# Altium project PD_SMARTKEY_EMN-EVAN_V2.0.PrjPcb
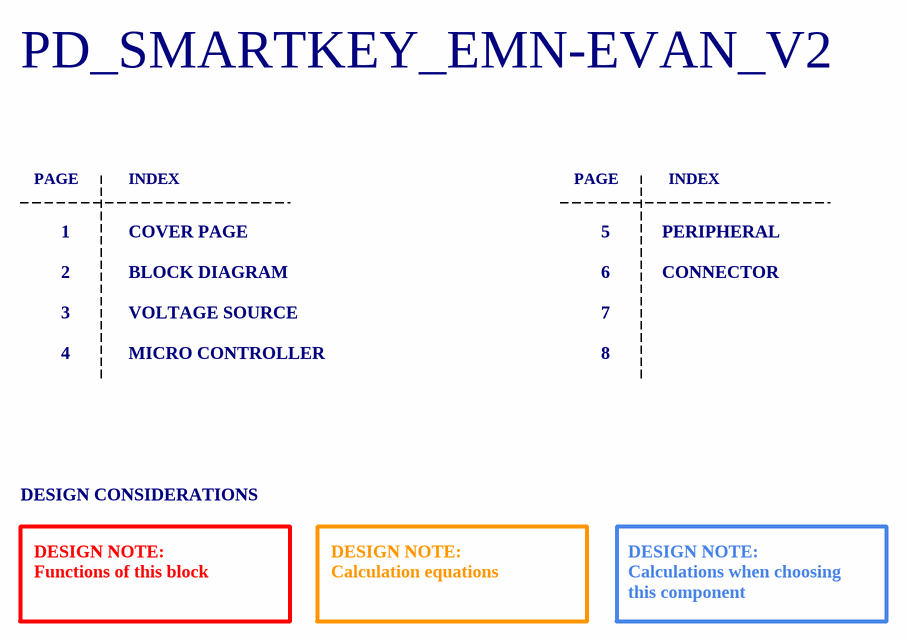
[diagram p0: Cover Page.SchDoc]
6 sheets, 81 parts. Net scope: global (net labels, ports and power ports of the same name join across sheets).
Sheets:
  Cover Page.SchDoc
  Block Diagram.SchDoc
  Voltage Source.SchDoc
  Micro Controller.SchDoc
  Peripheral.SchDoc
  Connector.SchDoc

## Sheet Cover Page.SchDoc
size A4; SheetNumber: 1; SheetTotal: 6

### Notes on the sheet
- PD_SMARTKEY_EMN-EVAN_V2
- PAGE
- INDEX
- 1
- 2
- COVER PAGE
- BLOCK DIAGRAM
- 5
- 6
- PERIPHERAL
- CONNECTOR
- 3
- 4
- VOLTAGE SOURCE
- MICRO CONTROLLER
- 7
- 8
- DESIGN CONSIDERATIONS
- DESIGN NOTE:
  Functions of this block
- DESIGN NOTE:
  Calculation equations
- DESIGN NOTE:
  Calculations when choosing this component
- Author:
- Title:
- Size:
- A4
- Project:
- Approved:
- Revision:
- Modified Date:
- CONFIDENTIAL
- Date:
- SW Version:

## Sheet Block Diagram.SchDoc
size A4; SheetNumber: 2; SheetTotal: 5

### Notes on the sheet
- Author:
- Title:
- Size:
- A4
- Project:
- Approved:
- Revision:
- Modified Date:
- CONFIDENTIAL
- Date:
- SW Version:

## Sheet Voltage Source.SchDoc
size A4; SheetNumber: 3; SheetTotal: 5
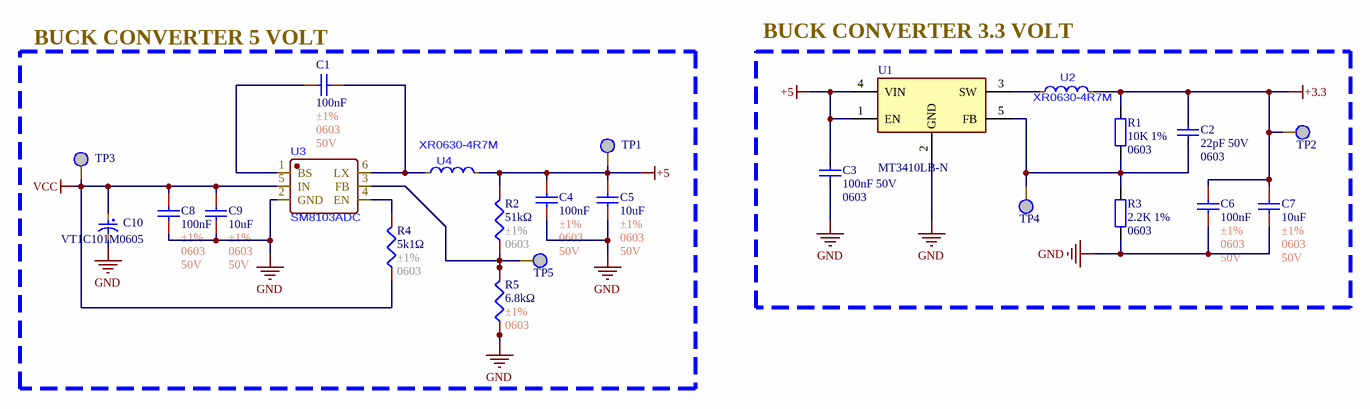
[diagram p1: Voltage Source.SchDoc]

### Parts
C1  100nF  Tolerance: ±1%  Package: 0603  Voltage Rating: 50V  [C0603]
C2  22pF 50V  Package: 0603  [C0603]
C3  100nF 50V  Package: 0603  [C0603]
C4  100nF  Tolerance: ±1%  Package: 0603  Voltage Rating: 50V  [C0603]
C5  10uF  Tolerance: ±1%  Package: 0603  Voltage Rating: 50V  [C0603]
C6  100nF  Tolerance: ±1%  Package: 0603  Voltage Rating: 50V  [C0603]
C7  10uF  Tolerance: ±1%  Package: 0603  Voltage Rating: 50V  [C0603]
C8  100nF  Tolerance: ±1%  Package: 0603  Voltage Rating: 50V  [C0603]
C9  10uF  Tolerance: ±1%  Package: 0603  Voltage Rating: 50V  [C0603]
C10  VT1C101M0605  [C_100uF_16V_Aluminum]
R1  10K 1%  Package: 0603  [RES_SMD_0603]
R2  51kΩ  Tolerance: ±1%  Package: 0603  [R0603]
R3  2.2K 1%  Package: 0603  [RES_SMD_0603]
R4  5k1Ω  Tolerance: ±1%  Package: 0603  [R0603]
R5  6.8kΩ  Tolerance: ±1%  Package: 0603  [R0603]
TP1  TP  [TP]  (value not drawn)
TP2  TP  [TP]  (value not drawn)
TP3  TP  [TP]  (value not drawn)
TP4  TP  [TP]  (value not drawn)
TP5  TP  [TP]  (value not drawn)
U1  MT3410LB-N  [SOT23_5]
U2  XR0630-4R7M  [SMD,7x6.6mm]
U3  SM8103ADC  [TSOT-23-6]
U4  XR0630-4R7M  [SMD,7x6.6mm]

### Blocks framed on the sheet
BUCK CONVERTER 5 VOLT: C1 C4 C5 C8-C10 R2 R4 R5 TP1 TP3 TP5 U3 U4
BUCK CONVERTER 3.3 VOLT: C2 C3 C6 C7 R1 R3 TP2 TP4 U1 U2

### Nets
+3.3: C2.2 C6.1 C7.1 R1.2 TP2.1 U2.2(F)
+5: C3.2 C4.1 C5.1 R2.2 TP1.1 U1.1(EN) U1.4(VIN) U4.2(F)
GND: C3.1 C4.2 C5.2 C6.2 C7.2 C8.2 C9.2 C10.2 R3.1 R5.1 U1.2(GND) U3.2(GND)
VCC: C8.1 C9.1 C10.1 R4.1 TP3.1 U3.5(IN)
NetC1_1: C1.1 U3.6(LX) U4.1(S)
NetC1_2: C1.2 U3.1(BS)
NetC2_1: C2.1 R1.1 R3.2 TP4.1 U1.5(FB)
NetR2_1: R2.1 R5.2 TP5.1 U3.3(FB)
NetR4_2: R4.2 U3.4(EN)
NetU1_3: U1.3(SW) U2.1(S)

### Notes on the sheet
- Author:
- Title:
- Size:
- A4
- Project:
- Approved:
- Revision:
- Modified Date:
- CONFIDENTIAL
- Date:
- SW Version:

### Library data of the parts
C1 C4 C6 C8 = C0603_100nF_±1%: Manufacturer: YAGEO; Mfr. Part #: CC0402FRNPO9BN100; LCSC Part #: C513681; Link: https://www.lcsc.com/product-detail/C513681.html?s_z=n_capital%2520yageo%252010pF%25200402; Capacitance: 100nF
C2 = C0603_MLCC_22pF_50V: 50V 22pF NP0 ±5% 0603 Multilayer Ceramic Capacitors MLCC - SMD/SMT ROHS; Manufacturer: YAGEO; Manufacture Part Number: CC0603JRNPO9BN220; Packaging: Cut Tape (CT); Link: https://www.lcsc.com/product-detail/Multilayer-Ceramic-Capacitors-MLCC-SMD-SMT_YAGEO-CC0603JRNPO9BN220_C105620.html?s_z=n_22pF%2050V%200603
C3 = C0603_MLCC_100nF_50V: 50V 100nF X7R ±10% 0603 Multilayer Ceramic Capacitors MLCC - SMD/SMT ROHS; Manufacturer: YAGEO; Manufacture Part Number: CC0603KRX7R9BB104; Packaging: Cut Tape (CT); Link: https://www.lcsc.com/product-detail/Multilayer-Ceramic-Capacitors-MLCC-SMD-SMT_YAGEO-CC0603KRX7R9BB104_C14663.html?s_z=n_100nF%2050V%200603
C5 C7 C9 = C0603_10uF_±1%: Manufacturer: YAGEO; Mfr. Part #: CC0402FRNPO9BN100; LCSC Part #: C513681; Link: https://www.lcsc.com/product-detail/C513681.html?s_z=n_capital%2520yageo%252010pF%25200402; Capacitance: 10uF
C10 = C_100uF_16V_aluminum: 100uF 16V ±20% 63mA@120Hz SMD,D6.3xL5.4mm Aluminum Electrolytic Capacitors RoHS; Manufacturer: ROQANG; Key Attributes: CAP ALUM 100uF ±20% 16V SMD; Mfr. Part #: VT1C101M0605; LCSC Part #: C90273; Package: SMD,D6.3xL5.4mm; Link: https://www.lcsc.com/product-detail/C90273.html?s_z=n_capital%2520100uf%2520aluminum
R1 = R0603_10K: 10 kOhms ±1% 0.1W, 1/10W Chip Resistor 0603 (1608 Metric) Moisture Resistant Thick Film; Manufacturer: YAGEO; Manufacture Part Number: RC0603FR-0710KL; Packaging: Cut Tape (CT); Link: https://www.digikey.com/en/products/detail/yageo/RC0603FR-0710KL/726880
R2 = R0603_51kΩ_±1%: 100mW Thick Film Resistor 75V ±100ppm/℃ ±1% 51kΩ 0603 Chip Resistor - Surface Mount ROHS; Manufacturer: FOJAN; Mfr. Part #: FRC0603F5101TS; Key Attributes: RES 5.1kΩ ±1% 100mW 0603; LCSC Part #: C2907044; Link: https://www.lcsc.com/product-detail/C2907044.html?s_z=n_5k1%25200603; Resistance: 51kΩ
R3 = R0603_2.2K: 2.2 kOhms ±1% 0.1W, 1/10W Chip Resistor 0603 (1608 Metric) Moisture Resistant Thick Film; Manufacturer: YAGEO; Manufacture Part Number: RC0603FR-072K2L; Packaging: Cut Tape (CT); Link: https://www.digikey.com/en/products/detail/yageo/RC0603FR-072K2L/727016
R4 = R0603_5k1Ω_±1%: 100mW Thick Film Resistor 75V ±100ppm/℃ ±1% 5.1kΩ 0603 Chip Resistor - Surface Mount ROHS; Manufacturer: FOJAN; Mfr. Part #: FRC0603F5101TS; Key Attributes: RES 5.1kΩ ±1% 100mW 0603; LCSC Part #: C2907044; Link: https://www.lcsc.com/product-detail/C2907044.html?s_z=n_5k1%25200603; Resistance: 5k1Ω
R5 = R0603_6.8kΩ_±1%_1: 6.8k; Manufacturer: YAGEO; Mfr. Part #: RC0402FR-0710RL; LCSC Part #: C138066; Resistance: 6.8kΩ; Link: https://www.lcsc.com/product-detail/C138066.html?s_z=n_resistor%25200402%252010R
U1 = MT3410LB-N: SOT-23-5 DC-DC Converters ROHS; Manufacturer: XI'AN Aerosemi Tech; Manufacture Part Number: MT3410LB-N; Packaging: Cut Tape; Link: https://www.lcsc.com/product-detail/DC-DC-Converters_XI-AN-Aerosemi-Tech-MT3410LB-N_C42420805.html?s_z=n_mt3410l; Package: SOT-23-5
U2 U4 = FIXED IND 4.7uH 6A 33mΩ SMD,0630: Manufacturer: XR; MPN: XR0630-4R7M; LCSC Part #: C5307631; Packaging: SMD,7x6.6mm; Link: https://www.lcsc.com/product-detail/C5307631.html?s_z=n_q_t_INDUCTOR%25200630&spm=wm.fly.bg.0.xh___wm.ssy.tc.0.tz&lcsc_vid=FFlaVlZURFlbX1EAE1lbUlZfQwdeBlBRQ1VZBFdQQwUxVlNeRlRfU1ZRQlNZXzsOAxUeFF5JWBYZEEoKFBINSQcJGk4eFQsCAgIaSgADAwAHC0slQ1ZXV1NWWQkaCgg%3D
U3 = SM8103ADC: High Efficiency, 3.0A, 18V Input Synchronous Step Down Regulator; Manufacturer: Silergy; MPN: SM8103ADC; LCSC Part #: C479070; Packaging: TSOT-23-6; Link: https://www.lcsc.com/product-detail/C479070.html?s_z=s_p_SM8103ADC&spm=wm.fly.bg.0.xh&lcsc_vid=FFlaVlZURFlbX1EAE1lbUlZfQwdeBlBRQ1VZBFdQQwUxVlNeRlReUVRTQVFeUDsOAxUeFF5JWBYZEEoKFBINSQcJGk4dAgUUFAk%3D

## Sheet Micro Controller.SchDoc
size A4; SheetNumber: 4; SheetTotal: 6
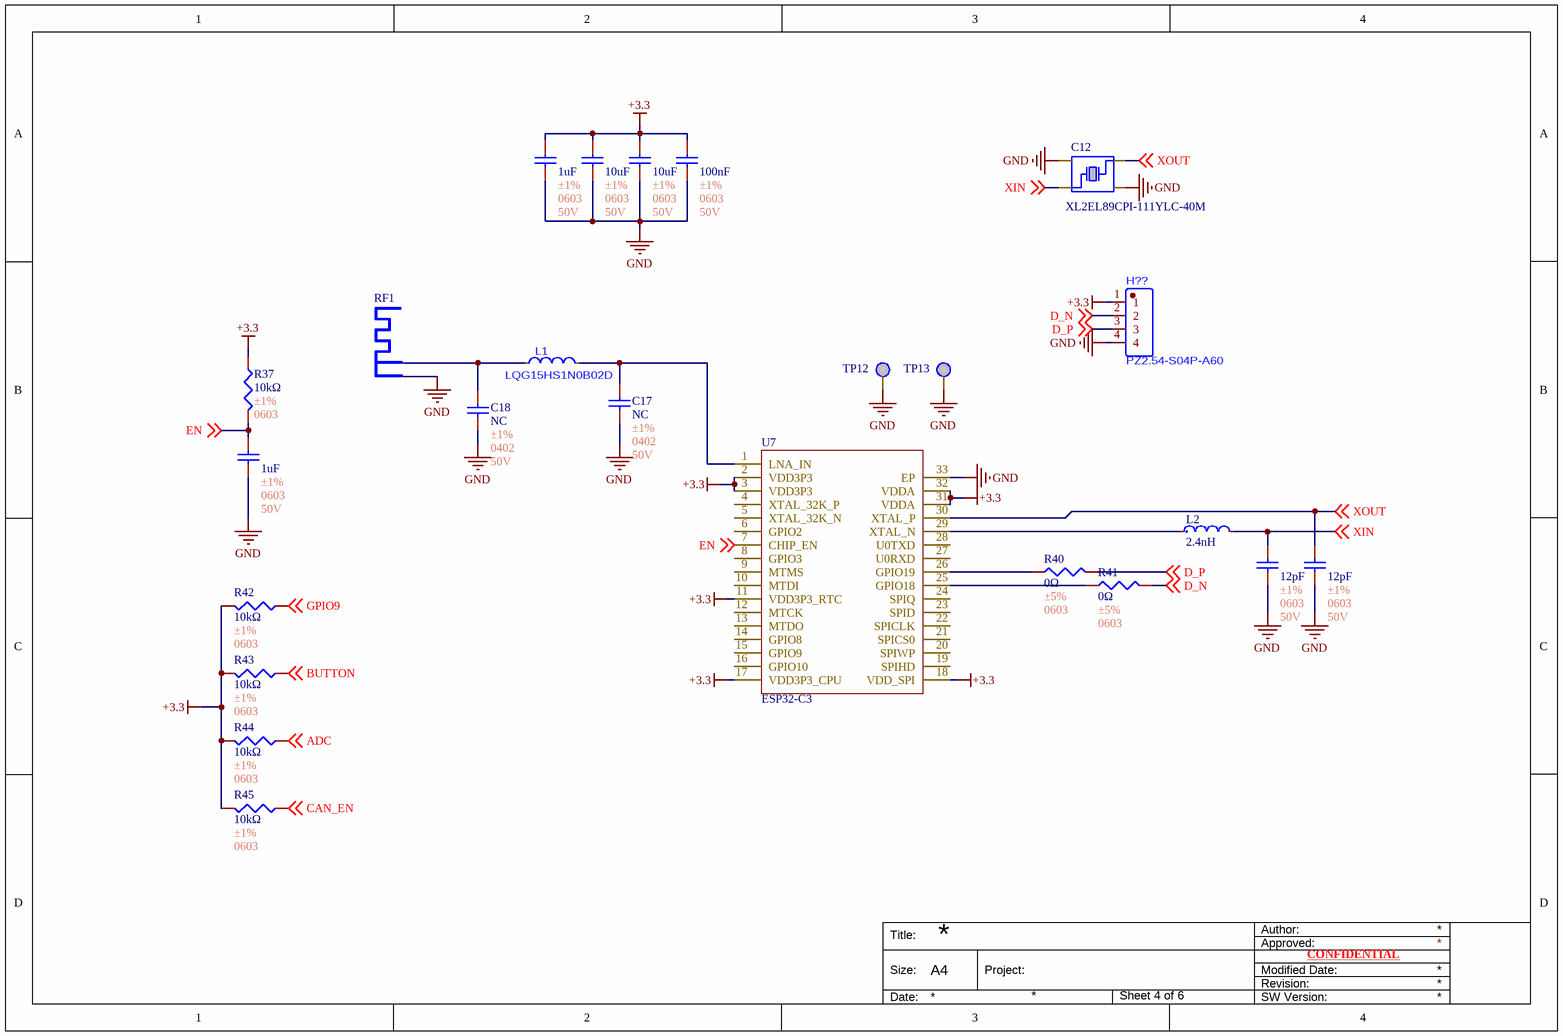
[diagram p2: Micro Controller.SchDoc]

### Parts
(Parts that share a designator on the sheet are numbered #1, #2 ... from top to bottom, then left to right.)
C12  XL2EL89CPI-111YLC-40M  [XL2EL89CPI-111YLC-40M]
C13  1uF  Tolerance: ±1%  Package: 0603  Voltage Rating: 50V  [C0603]
C14  10uF  Tolerance: ±1%  Package: 0603  Voltage Rating: 50V  [C0603]
C15  10uF  Tolerance: ±1%  Package: 0603  Voltage Rating: 50V  [C0603]
C16  100nF  Tolerance: ±1%  Package: 0603  Voltage Rating: 50V  [C0603]
C17  NC  Tolerance: ±1%  Package: 0402  Voltage Rating: 50V  [C0402]
C18  NC  Tolerance: ±1%  Package: 0402  Voltage Rating: 50V  [C0402]
C19  1uF  Tolerance: ±1%  Package: 0603  Voltage Rating: 50V  [C0603]
C20  12pF  Tolerance: ±1%  Package: 0603  Voltage Rating: 50V  [C0603]
C21  12pF  Tolerance: ±1%  Package: 0603  Voltage Rating: 50V  [C0603]
H??#1  PZ2.54-S04P-A60  [J_4P_XH2.54]
L1  LQG15HS1N0B02D  [L0402_1nH]
L2  2.4nH
R37  10kΩ  Tolerance: ±1%  Package: 0603  [R0603]
R40  0Ω  Tolerance: ±5%  Package: 0603  [R0603]
R41  0Ω  Tolerance: ±5%  Package: 0603  [R0603]
R42  10kΩ  Tolerance: ±1%  Package: 0603  [R0603]
R43  10kΩ  Tolerance: ±1%  Package: 0603  [R0603]
R44  10kΩ  Tolerance: ±1%  Package: 0603  [R0603]
R45  10kΩ  Tolerance: ±1%  Package: 0603  [R0603]
RF1  (no value)  [2.4GHZ-50OHMS_v1.1]
TP12  TP  [TP]  (value not drawn)
TP13  TP  [TP]  (value not drawn)
U7  ESP32-C3  [ESP32-C3]

### Nets
+3.3: C13.1 C14.1 C15.1 C16.1 H??#1.1 R37.1 R42.2 R43.2 R44.2 R45.2 U7.2(VDD3P3) U7.3(VDD3P3) U7.11(VDD3P3_RTC) U7.17(VDD3P3_CPU) U7.18(VDD_SPI) U7.31(VDDA) U7.32(VDDA)
GND: C12.2 C12.4 C13.2 C14.2 C15.2 C16.2 C17.2 C18.2 C19.2 C20.2 C21.2 H??#1.4 RF1.2 TP12.1 TP13.1 U7.33(EP)
ADC: R44.1 ; off-sheet ADC
BUTTON: R43.1 ; off-sheet BUTTON
CAN_EN: R45.1 ; off-sheet CAN_EN
D_N: H??#1.2 R41.2 ; off-sheet D_N
D_P: H??#1.3 R40.2 ; off-sheet D_P
EN: C19.1 R37.2 U7.7(CHIP_EN) ; off-sheet EN
GPIO9: R42.1 ; off-sheet GPIO9
XIN: C12.1 C20.1 L2.2 ; off-sheet XIN
XOUT: C12.3 C21.1 U7.30(XTAL_P) ; off-sheet XOUT
NetC17_1: C17.1 L1.2 U7.1(LNA_IN)
NetC18_1: C18.1 L1.1 RF1.1
NetL2_1: L2.1 U7.29(XTAL_N)
NetR40_1: R40.1 U7.26(GPIO19)
NetR41_1: R41.1 U7.25(GPIO18)

Not connected (* = marked no-connect by the designer): U7 4(XTAL_32K_P) 5(XTAL_32K_N) 6(GPIO2) 8(GPIO3) 9(MTMS) 10(MTDI) 12(MTCK) 13(MTDO) 14(GPIO8) 15(GPIO9) 16(GPIO10) 19(SPIHD) 20(SPIWP) 21(SPICS0) 22(SPICLK) 23(SPID) 24(SPIQ) 27(U0RXD) 28(U0TXD)

### Notes on the sheet
- Author:
- Title:
- Size:
- A4
- Project:
- Approved:
- Revision:
- Modified Date:
- CONFIDENTIAL
- Date:
- SW Version:

### Library data of the parts
C12 = XL2EL89CPI-111YLC-40M: Crystal Oscillator 15pF SMD3225-4P Crystals RoHS; Manufacturer: YXC Crystal Oscillators; Mfr. Part #: XL2EL89CPI-111YLC-40M; LCSC Part #: C5444549; Package: SMD3225-4P; Link: https://www.lcsc.com/product-detail/C5444549.html?s_z=n_oscillator; Key Attributes: Crystal Oscillator 15pF SMD3225-4P Crystals RoHS
C13 C19 = C0603_1uF_±1%: 50V 10pF NP0 ±1% 0402 Multilayer Ceramic Capacitors MLCC - SMD/SMT ROHS; Manufacturer: YAGEO; Mfr. Part #: CC0402FRNPO9BN100; LCSC Part #: C513681; Link: https://www.lcsc.com/product-detail/C513681.html?s_z=n_capital%2520yageo%252010pF%25200402; Capacitance: 1uF
C14 C15 = C0603_10uF_±1%: 50V 10pF NP0 ±1% 0402 Multilayer Ceramic Capacitors MLCC - SMD/SMT ROHS; Manufacturer: YAGEO; Mfr. Part #: CC0402FRNPO9BN100; LCSC Part #: C513681; Link: https://www.lcsc.com/product-detail/C513681.html?s_z=n_capital%2520yageo%252010pF%25200402; Capacitance: 10uF
C16 = C0603_100nF_±1%: 50V 10pF NP0 ±1% 0402 Multilayer Ceramic Capacitors MLCC - SMD/SMT ROHS; Manufacturer: YAGEO; Mfr. Part #: CC0402FRNPO9BN100; LCSC Part #: C513681; Link: https://www.lcsc.com/product-detail/C513681.html?s_z=n_capital%2520yageo%252010pF%25200402; Capacitance: 100nF
C17 C18 = C0402_NC_±1%: Manufacturer: YAGEO; Mfr. Part #: CC0402FRNPO9BN100; Capacitance: 1uF; LCSC Part #: C513681; Link: https://www.lcsc.com/product-detail/C513681.html?s_z=n_capital%2520yageo%252010pF%25200402
C20 C21 = C0603_12pF_±1%: 50V 10pF NP0 ±1% 0402 Multilayer Ceramic Capacitors MLCC - SMD/SMT ROHS; Manufacturer: YAGEO; Mfr. Part #: CC0402FRNPO9BN100; LCSC Part #: C513681; Link: https://www.lcsc.com/product-detail/C513681.html?s_z=n_capital%2520yageo%252010pF%25200402; Capacitance: 12pF
H??#1 = J_4P_XH2.54: 1kV 1 2.54mm Pin Header 3A 2.5mm Through Hole 6mm -40℃~+105℃ 3mm Gold 4P Black 1x4P Through Hole,P=2.54mm Headers, Male Pins RoHS; Manufacturer: JXTCONN; MPN: PZ2.54-S04P-A60; LCSC Part #: C42431795; Packaging: Through Hole,P=2.54mm; Link: https://www.lcsc.com/product-detail/C42431795.html?s_z=n_q_t_header%25204%2520p&spm=wm.fly.bg.0.xh___wm.ssy.tc.0.tz&lcsc_vid=FlRcBlcDRFNZAlJQT1RZBVJSEVFcX11eRVQPBFEHFgAxVlNeQVVcV1RRRlFeUzsOAxUeFF5JWBYZEEoKFBINSQcJGk4dAgUUFAk%3D
L1 = L0402_1nH: FIXED IND 1nH 1A 70mΩ 0402; Manufacturer: muRata; MPN: LQG15HS1N0B02D; LCSC Part #: C162538; Packaging: 0402; Link: https://www.lcsc.com/product-detail/C162538.html?s_z=n_q_0402%2520inductor%25201nH&spm=wm.fly.bg.1.xh&lcsc_vid=FFlaVlZURFlbX1EAE1lbUlZfQwdeBlBRQ1VZBFdQQwUxVlNeQ1FfVlBVRFlZVjsOAxUeFF5JWBYZEEoKFBINSQcJGk4NBhADEA4cHktXRllfSQwSGg0%3D
L2 = L_0402_24nH: FIXED IND 24nH 350mA 430mΩ 0402; Manufacturer: TDK; Mfr. Part #: MLG1005S24NHTD25; LCSC Part #: C404641; Package: 0402; Link: https://www.lcsc.com/product-detail/C404641.html?s_z=n_q_inductor%252024nH&spm=wm.fly.bg.1.xh&lcsc_vid=FlRcBlcDRFNZAlJQT1RZBVJSEVFcX11eRVQPBFEHFgAxVlNeQVVfX11XQFdfVzsOAxUeFF5JWBYZEEoKFBINSQcJGk4NBhADEA4cHktTQlhADxALGw%3D%3D; Inductance: 2.4nH
R37 R42-R45 = R0603_10kΩ_±1%: 62.5mW Thick Film Resistor 50V ±1% ±200ppm/℃ 10Ω 0402 Chip Resistor - Surface Mount ROHS; Manufacturer: YAGEO; Mfr. Part #: RC0402FR-0710RL; LCSC Part #: C138066; Resistance: 10kΩ; Link: https://www.lcsc.com/product-detail/C138066.html?s_z=n_resistor%25200402%252010R
R40 R41 = R0603_0Ω_±5%: 100mW Thick Film Resistor 75V ±5% 0Ω 0603 Chip Resistor - Surface Mount ROHS; Manufacturer: YAGEO; Mfr. Part #: RC0603JR-070RL; Key Attributes: RES 0Ω ±5% 100mW 0603; LCSC Part #: C95177; Resistance: 0Ω; Link: https://www.lcsc.com/product-detail/C138066.html?s_z=n_resistor%25200402%252010R
RF1 = Antenna
U7 = ESP32-C3: Others 160MHz QFN-32-EP(5x5) RF Transceiver Modules and Modems RoHS; Manufacturer: ESPRESSIF; LCSC Part #: C2838500; Package: QFN-32-EP(5x5); Link: https://www.lcsc.com/product-detail/C2838500.html?s_z=n_ESP32%2520C3; MPN: ESP32-C3

## Sheet Peripheral.SchDoc
size A3; SheetNumber: 5; SheetTotal: 6; ProjectTitle: DSP_VERSION_1.0
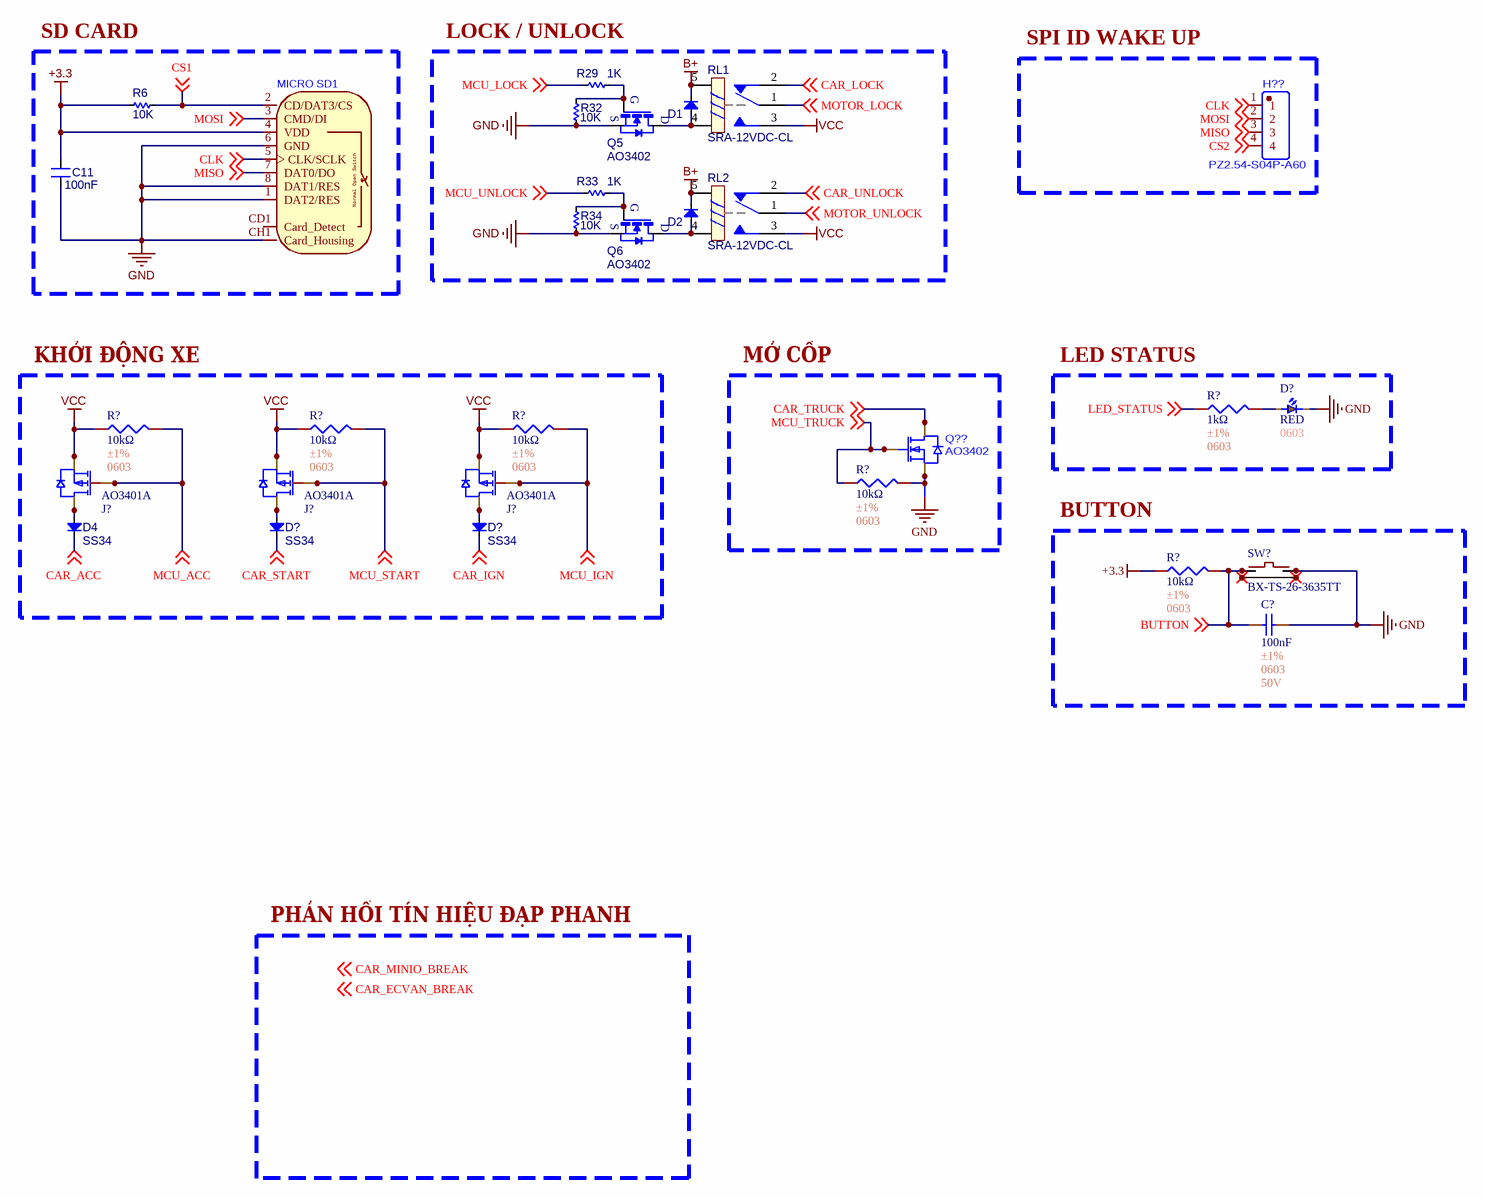
[diagram p3: Peripheral.SchDoc]

### Parts
(Parts that share a designator on the sheet are numbered #1, #2 ... from top to bottom, then left to right.)
C11  100nF  [C-0603]
C?  100nF  Tolerance: ±1%  Package: 0603  Voltage Rating: 50V  [C0603]
D1  1N5819  [SOD-323]  (value not drawn)
D2  1N5819  [SOD-323]  (value not drawn)
D4  SS34  [DIO-SMD-106]
D?#1  RED  Package: 0603  [LED0603]
D?#2  SS34  [DIO-SMD-106]
D?#3  SS34  [DIO-SMD-106]
H??#2  PZ2.54-S04P-A60  [J_4P_XH2.54]
J?#1  AO3401A  [AO3401]
J?#2  AO3401A  [AO3401]
J?#3  AO3401A  [AO3401]
MICRO_SD1  ATFFS150A01BR016  [USD(TFC-9P-1.XH(ATFFS150A01BR016))]  (value not drawn)
Q5  AO3402  [SOT23-3]
Q6  AO3402  [SOT23-3]
Q??  AO3402  [AO3402]
R6  10K  [RES-SMD-0603]
R29  1K  [RES-SMD-0603]
R32  10K  [RES-SMD-0603]
R33  1K  [RES-SMD-0603]
R34  10K  [RES-SMD-0603]
R?#1  1kΩ  Tolerance: ±1%  Package: 0603  [R0603]
R?#2  10kΩ  Tolerance: ±1%  Package: 0603  [R0603]
R?#3  10kΩ  Tolerance: ±1%  Package: 0603  [R0603]
R?#4  10kΩ  Tolerance: ±1%  Package: 0603  [R0603]
R?#5  10kΩ  Tolerance: ±1%  Package: 0603  [R0603]
R?#6  10kΩ  Tolerance: ±1%  Package: 0603  [R0603]
RL1  SRA-12VDC-CL  [YL318-DC12V-C]
RL2  SRA-12VDC-CL  [YL318-DC12V-C]
SW?  BX-TS-26-3635TT  [BX-TS-26-3635TT]

### Blocks framed on the sheet
SD CARD: C11 MICRO_SD1 R6
LOCK / UNLOCK: D1 D2 Q5 Q6 R29 R32-R34 RL1 RL2
SPI ID WAKE UP: H??#2
KHỞI ĐỘNG XE: D4 D?#2 D?#3 J?#1-J?#3 R?#2-R?#4
MỞ CỐP: Q?? R?#5
LED STATUS: D?#1 R?#1
BUTTON: C? R?#6 SW?

### Nets
+3.3: C11.2 MICRO_SD1.4(VDD) R6.1 R?#6.1
B+: D1.2(K) D2.2(K) RL1.5 RL2.5
GND: C11.1 C?.1 D?#1.1 MICRO_SD1.1(DAT2/RES) MICRO_SD1.6(GND) MICRO_SD1.8(DAT1/RES) MICRO_SD1.CH1(Card_Housing) Q5.2(S) Q6.2(S) Q??.2(S) R32.1 R34.1 R?#5.2 SW?.2
VCC: J?#1.2(S) J?#2.2(S) J?#3.2(S) R?#2.1 R?#3.1 R?#4.1 RL1.3 RL2.3
BUTTON: C?.2 R?#6.2 SW?.1 ; off-sheet BUTTON
CAR_ACC: D4.2(K) ; off-sheet CAR_ACC
CAR_IGN: D?#3.2(K) ; off-sheet CAR_IGN
CAR_LOCK: RL1.2 ; off-sheet CAR_LOCK
CAR_START: D?#2.2(K) ; off-sheet CAR_START
CAR_TRUCK: Q??.3(D) ; off-sheet CAR_TRUCK
CAR_UNLOCK: RL2.2 ; off-sheet CAR_UNLOCK
CLK: H??#2.1 MICRO_SD1.5(CLK/SCLK) ; off-sheet CLK
CS1: MICRO_SD1.2(CD/DAT3/CS) R6.2 ; off-sheet CS1
CS2: H??#2.4 ; off-sheet CS2
LED_STATUS: R?#1.1 ; off-sheet LED_STATUS
MCU_ACC: J?#1.1(G) R?#2.2 ; off-sheet MCU_ACC
MCU_IGN: J?#3.1(G) R?#4.2 ; off-sheet MCU_IGN
MCU_LOCK: R29.2 ; off-sheet MCU_LOCK
MCU_START: J?#2.1(G) R?#3.2 ; off-sheet MCU_START
MCU_TRUCK: Q??.1(G) R?#5.1 ; off-sheet MCU_TRUCK
MCU_UNLOCK: R33.2 ; off-sheet MCU_UNLOCK
MISO: H??#2.3 MICRO_SD1.7(DAT0/DO) ; off-sheet MISO
MOSI: H??#2.2 MICRO_SD1.3(CMD/DI) ; off-sheet MOSI
MOTOR_LOCK: RL1.1 ; off-sheet MOTOR_LOCK
MOTOR_UNLOCK: RL2.1 ; off-sheet MOTOR_UNLOCK
NetD1_1: D1.1(A) Q5.3(D) RL1.4
NetD2_1: D2.1(A) Q6.3(D) RL2.4
NetD4_1: D4.1(A) J?#1.3(D)
NetD?#1_2: D?#1.2 R?#1.2
NetD?#2_1: D?#2.1(A) J?#2.3(D)
NetD?#3_1: D?#3.1(A) J?#3.3(D)
NetQ5_1: Q5.1(G) R29.1 R32.2
NetQ6_1: Q6.1(G) R33.1 R34.2

Not connected (* = marked no-connect by the designer): MICRO_SD1 CD1(Card_Detect); SW? 3* 4*

### Notes on the sheet
- PHẢN HỒI TÍN HIỆU ĐẠP PHANH
- Labels drawn without touching a wire or pin: CAR_ECVAN_BREAK, CAR_MINIO_BREAK
- Author:
- Title:
- Size:
- A3
- Project:
- Revision:
- Modified Date:
- CheckedBy:
- Date:
- SW Version:
- (in symbol MICRO_SD) Normal Open Switch

### Library data of the parts
C11 = CM: Cap SMD; Value: 103
C? = C0603_100nF_±1%: as C1 on sheet Voltage Source; LCSC Part #: C513681; Link: https://www.lcsc.com/product-detail/C513681.html?s_z=n_capital%2520yageo%252010pF%25200402; Capacitance: 100nF
D1 D2 D4 D?#2 D?#3 = Diode SMD: Default Diode; Code - JEDEC: DO-214-AB; Value: 1N5007; Published: 8-Jun-2000; Revision: July-2002: Re-released for DXP Platform.; Publisher: Altium Limited
D?#1 = D0603_RED: 25mcd~40mcd Water Clear -40℃~+85℃ 624nm Red 120° 60mW 0402 LED Indication - Discrete ROHS; Manufacturer: XINGLIGHT; Mfr. Part #: XL-1005UGC; Voltage - Forward(Vf): 3V; LCSC Part #: C965793; Power(Watts): 60mW; Link: https://www.lcsc.com/product-detail/C136765.html?s_z=n_LED%25200402%2520RED; Illumination Color: RED
H??#2 = J_4P_XH2.54: as H??#1 on sheet Micro Controller; MPN: PZ2.54-S04P-A60; LCSC Part #: C42431795; Packaging: Through Hole,P=2.54mm; Link: https://www.lcsc.com/product-detail/C42431795.html?s_z=n_q_t_header%25204%2520p&spm=wm.fly.bg.0.xh___wm.ssy.tc.0.tz&lcsc_vid=FlRcBlcDRFNZAlJQT1RZBVJSEVFcX11eRVQPBFEHFgAxVlNeQVVcV1RRRlFeUzsOAxUeFF5JWBYZEEoKFBINSQcJGk4dAgUUFAk%3D
J?#1-J?#3 = AO3401: 30V 4A 900mV@250uA 1 P-Channel SOT-23 MOSFETs ROHS; Manufacturer: AOS; Mfr. Part #: AO3401A; LCSC Part #: C15127; Package: SOT-23; Current - Continuous Drain(Id): 4A; Drain to Source Voltage: 30V; Link: https://www.lcsc.com/product-detail/C15127.html?s_z=n_AO3401
MICRO_SD1 = MICRO_SD: TFC-9P-1.5H(ATFFS150A01BR016)
Q5 Q6 = SI2302DS: N-Channel 20V 2.5A _Tc_ 830mW _Tc_ Surface Mount TO-236AB _SOT23_; MF: NXP Semiconductors; SnapEDA_Link: https://www.snapeda.com/parts/SI2302DS/NXP%20Semiconductors/view-part/4701514/?ref=snap; Availability: Unavailable; MP: SI2302DS; Price: None; Value: *; Package: None
Q?? = AO3402: MOSFET N-CH 30V SOT-23; Manufacturer: AOS; MPN: AO3402; LCSC Part #: C14385; Packaging: SOT-23; Link: https://www.lcsc.com/product-detail/C14385.html?s_z=n_q_ao3402&spm=wm.fly.bg.0.xh&lcsc_vid=FFlaVlZURFlbX1EAE1lbUlZfQwdeBlBRQ1VZBFdQQwUxVlNeRVZXVF1QQ1BYXzsOAxUeFF5JWBYZEEoKFBINSQcJGk4NBhADEA4cHktXR1FWSQwSGg0%3D
R6 R29 R32-R34 = Res-SMD: Resistor; Manufacturer: Generic Components; Class: Passive; Published: 08/06/2000; Publisher: Altium Hobart Technology Centre
R?#1 = R0603_1kΩ_±1%: 62.5mW Thick Film Resistor 50V ±1% ±200ppm/℃ 10Ω 0402 Chip Resistor - Surface Mount ROHS; Manufacturer: YAGEO; Mfr. Part #: RC0402FR-0710RL; LCSC Part #: C138066; Resistance: 1kΩ; Link: https://www.lcsc.com/product-detail/C138066.html?s_z=n_resistor%25200402%252010R
R?#2-R?#6 = R0603_10kΩ_±1%: as R37 on sheet Micro Controller; LCSC Part #: C138066; Resistance: 10kΩ; Link: https://www.lcsc.com/product-detail/C138066.html?s_z=n_resistor%25200402%252010R
RL1 RL2 = Relay 1: Relay SPDT,10A - 12VDC 5 Pin; Value: Relay SPDT, 10A, 12V
SW? = BX-TS-26-3635TT: Without bracket 50mA 3.6mm 100000 Times 260gf 12V 3.5mm 3.5mm Rectangle button Standing paste SPST SMD,3x6mm Tactile Switches ROHS; Manufacturer: Bossie; Manufacture Part Number: C18078107; Packaging: Cut Tape; Link: https://www.lcsc.com/product-detail/Tactile-Switches_Bossie-BX-TS-26-3635TT_C18078107.html?s_z=n_tactile; Package: SMD,3x6mm

## Sheet Connector.SchDoc
size A4; SheetNumber: 5; SheetTotal: 5
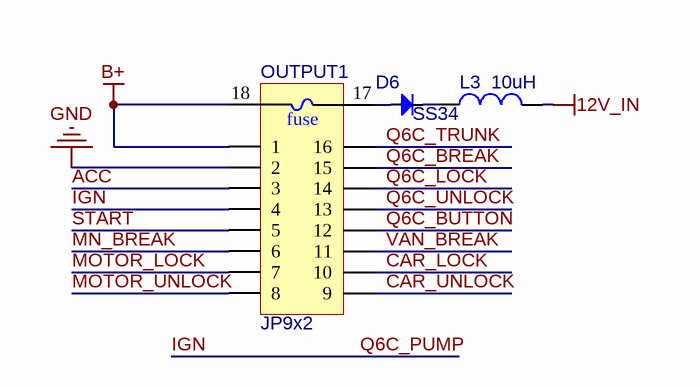
[diagram p4: Connector.SchDoc]

### Parts
D6  SS34  [DIO-SMD-106]
L3  10uH  [INDUCTOR_SMD_7X7MM]
OUTPUT1  JP9x2  [9x2_JP200]

### Nets
12V_IN: L3.2
B+: OUTPUT1.1 OUTPUT1.18
GND: OUTPUT1.2
ACC: OUTPUT1.3
CAR_LOCK: OUTPUT1.10
CAR_UNLOCK: OUTPUT1.9
IGN: OUTPUT1.4  [also labelled Q6C_PUMP]
MN_BREAK: OUTPUT1.6
MOTOR_LOCK: OUTPUT1.7
MOTOR_UNLOCK: OUTPUT1.8
Q6C_BREAK: OUTPUT1.15
Q6C_BUTTON: OUTPUT1.12
Q6C_LOCK: OUTPUT1.14
Q6C_TRUNK: OUTPUT1.16
Q6C_UNLOCK: OUTPUT1.13
START: OUTPUT1.5
VAN_BREAK: OUTPUT1.11
NetD6_1: D6.1(A) OUTPUT1.17
NetD6_2: D6.2(K) L3.1

### Notes on the sheet
- Author:
- Title:
- Size:
- A4
- Project:
- Approved:
- Revision:
- Modified Date:
- CONFIDENTIAL
- Date:
- SW Version:
- (in symbol JP9x2_1) fuse

### Library data of the parts
D6 = Diode SMD: as D1 on sheet Peripheral; Published: 8-Jun-2000; Revision: July-2002: Re-released for DXP Platform.; Publisher: Altium Limited
L3 = Inductor_SMD: Inductor; Value: 150 mH
OUTPUT1 = JP9x2_1: WR-PHD 2.54 mm Dual Socket Header; Manufacturer: W¨¹rth Elektronik eiSos GmbH; partNo: 61301821821; ComponentLink1 Description: Manufacturer; ComponentLink2 Description: Datasheet; NoPins: 18; Created Date: 29 March 2013; ComponentLink1URL: http://www.we-online.com; ComponentLink2URL: http://katalog.we-online.de/em/datasheet/6130xx21821.pdf; Created by: Karrer Zheng

## Nets that join several sheets
+3.3: Voltage Source (6 pins), Micro Controller (17 pins), Peripheral (C11.2 MICRO_SD1.4 R6.1 R?#6.1)
B+: Peripheral (D1.2 D2.2 RL1.5 RL2.5), Connector (OUTPUT1.1 OUTPUT1.18)
GND: Voltage Source (12 pins), Micro Controller (16 pins), Peripheral (14 pins), Connector (OUTPUT1.2)
VCC: Voltage Source (6 pins), Peripheral (8 pins)
BUTTON: Micro Controller (R43.1), Peripheral (C?.2 R?#6.2 SW?.1)
CAR_LOCK: Peripheral (RL1.2), Connector (OUTPUT1.10)
CAR_UNLOCK: Peripheral (RL2.2), Connector (OUTPUT1.9)
MOTOR_LOCK: Peripheral (RL1.1), Connector (OUTPUT1.7)
MOTOR_UNLOCK: Peripheral (RL2.1), Connector (OUTPUT1.8)